# EAGLE schematic switch_board (EAGLE 8.3.1)
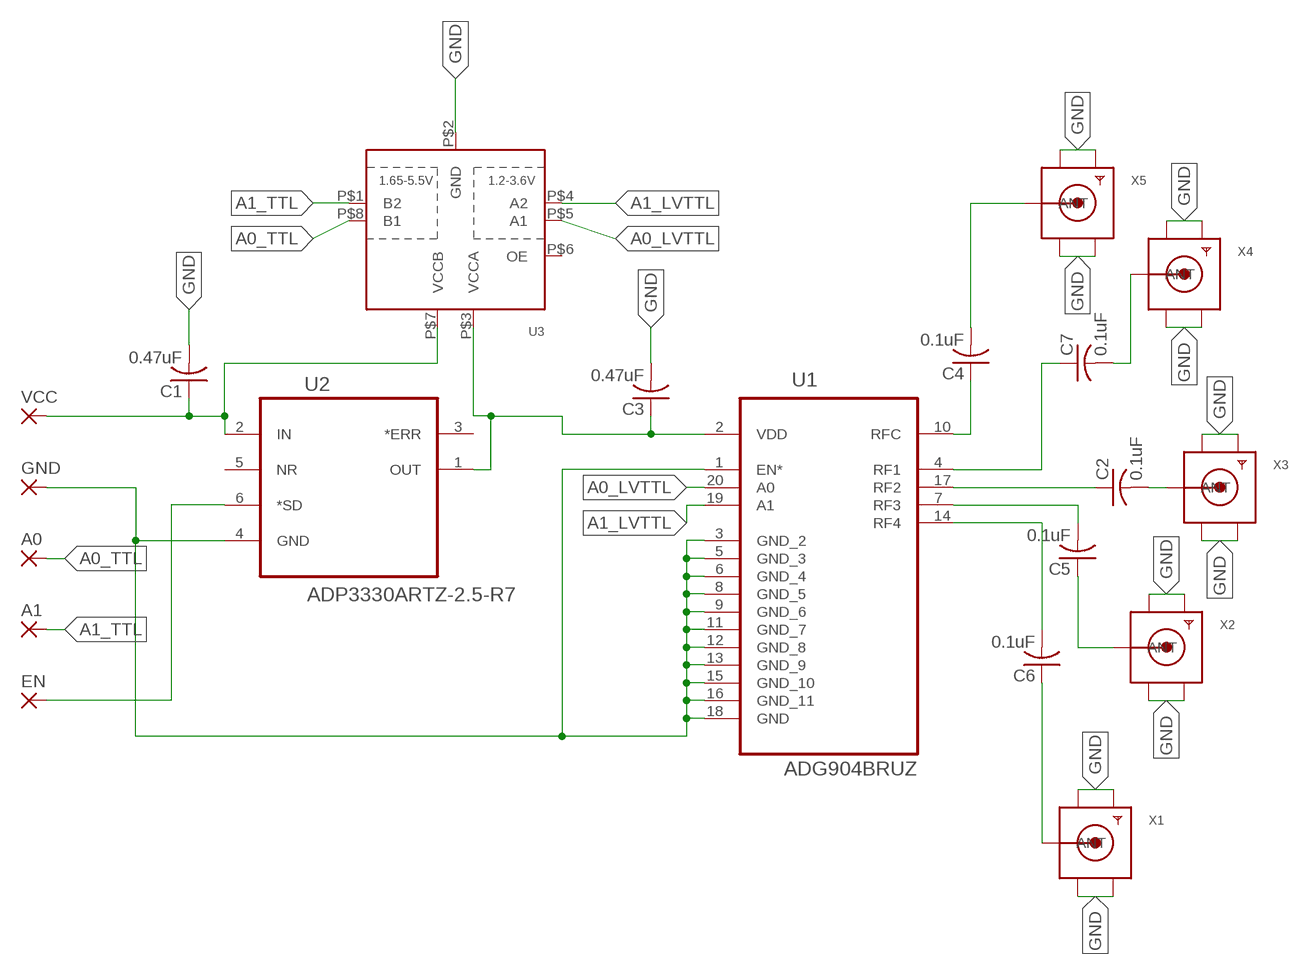
[diagram p0: schematic, sheet 1]

## Parts
A0  2,54/1,0  [2,54/1,0]
A1  2,54/1,0  [2,54/1,0]
C1  0.47uF  C-USC0603  [C0603]
C2  0.1uF  C-USC0603  [C0603]
C3  0.47uF  C-USC0603  [C0603]
C4  0.1uF  C-USC0603  [C0603]
C5  0.1uF  C-USC0603  [C0603]
C6  0.1uF  C-USC0603  [C0603]
C7  0.1uF  C-USC0603  [C0603]
EN  2,54/1,0  [2,54/1,0]
GND  2,54/1,0  [2,54/1,0]
U1  ADG904BRUZ  [SOP65P640X120-20N]
U2  ADP3330ARTZ-2.5-R7  [SOT95P280X145-6N]
U3  TXS0102  [VFSOP-8]
VCC  2,54/1,0  [2,54/1,0]
X1  SMACONNECTOR_EDGE  [SMA_EDGELAUNCH]
X2  SMACONNECTOR_EDGE  [SMA_EDGELAUNCH]
X3  SMACONNECTOR_EDGE  [SMA_EDGELAUNCH]
X4  SMACONNECTOR_EDGE  [SMA_EDGELAUNCH]
X5  SMACONNECTOR_EDGE  [SMA_EDGELAUNCH]

## Nets
A0_LVTTL: U1.20(A0) U3.P$5(A1)
A0_TTL: A0.1(P) U3.P$8(B1)
A1_LVTTL: U1.19(A1) U3.P$4(A2)
A1_TTL: A1.1(P) U3.P$1(B2)
GND: C1.2 C3.2 GND.1(P) U1.1(EN*) U1.3(GND_2) U1.5(GND_3) U1.6(GND_4) U1.8(GND_5) U1.9(GND_6) U1.11(GND_7) U1.12(GND_8) U1.13(GND_9) U1.15(GND_10) U1.16(GND_11) U1.18(GND) U2.4(GND) U3.P$2(GND) X1.GND@1(GND4) X1.GND@2(GND3) X1.GND@3(GND2) X1.GND@4(GND1) X2.GND@1(GND4) X2.GND@2(GND3) X2.GND@3(GND2) X2.GND@4(GND1) X3.GND@1(GND4) X3.GND@2(GND3) X3.GND@3(GND2) X3.GND@4(GND1) X4.GND@1(GND4) X4.GND@2(GND3) X4.GND@3(GND2) X4.GND@4(GND1) X5.GND@1(GND4) X5.GND@2(GND3) X5.GND@3(GND2) X5.GND@4(GND1)
N$1: EN.1(P) U2.6(*SD)
N$2: C1.1 U2.2(IN) U3.P$7(VCCB) VCC.1(P)
N$3: C5.1 X2.P(ANT)
N$4: C4.1 U1.10(RFC)
N$5: C2.1 U1.17(RF2)
N$6: C3.1 U1.2(VDD) U2.1(OUT) U3.P$3(VCCA)
N$7: C2.2 X3.P(ANT)
N$8: C7.2 X4.P(ANT)
N$9: C6.1 X1.P(ANT)
RF1: C7.1 U1.4(RF1)
RF3: C5.2 U1.7(RF3)
RF4: C6.2 U1.14(RF4)
RFC: C4.2 X5.P(ANT)
Unconnected: U2.3(*ERR) U2.5(NR) U3.P$6(OE)

## Library data of the parts
A0 A1 EN GND VCC = wirepad:2,54/1,0: THROUGH-HOLE PAD
C1-C7 = resistor:C-US: CAPACITOR, American symbol
U1 = ADI-Phase-2:ADG904BRUZ: MULTIPLEXER, 4X1, 20TSSOP; MPN: ADG904BRUZ; OC_FARNELL: 2074875; OC_NEWARK: 76T1736; PACKAGE: TSSOP-20; SUPPLIER: Analog Devices
U2 = ADI-Phase-2:ADP3330ARTZ-2.5-R7: Low Dropout Regulator; MPN: ADP3330ARTZ-2.5-R7; OC_FARNELL: 2074870; OC_NEWARK: 76T1764; PACKAGE: SOT-23-6; SUPPLIER: Analog Devices
U3 = adafruit:TXS0102: 2-Bit Bi-Directional Level Shifter (I2C, etc.) Designed for I2C devices and has internal pullups. Not to be confused with TXB010x series. 1.2V-3.6V (VCCA) to 1.65V-5.5V (VCCB) bi-directional level shifter with auto direction sensing. Max data rate - 24Mbps (Push Pull), 2Mbps (Open Drain) Digikey: 296-21931-1-ND
X1-X5 = adafruit:SMACONNECTOR: SMA Connector 90° DIP SMA Connector, 50 Ohm (4UConnector: 07259)

## Net classes
0 default: clearance 0.205 mm